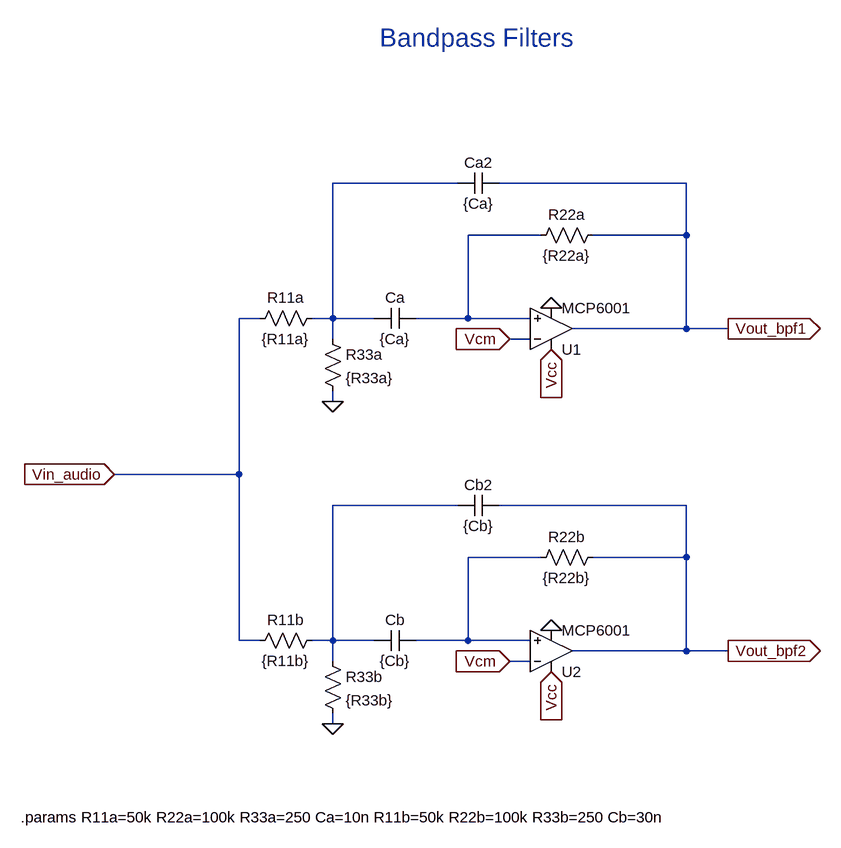
[diagram p0: schematic p6_instance.asc]
p6_instance.asc, the LTspice schematic file:
Version 4.1
SHEET 1 1460 960
WIRE 80 -96 -112 -96
WIRE 432 -96 144 -96
WIRE 208 -16 96 -16
WIRE 432 -16 432 -96
WIRE 432 -16 288 -16
WIRE -224 112 -256 112
WIRE -112 112 -112 -96
WIRE -112 112 -144 112
WIRE -48 112 -112 112
WIRE 96 112 96 -16
WIRE 96 112 16 112
WIRE 192 112 96 112
WIRE 432 128 432 -16
WIRE 432 128 256 128
WIRE 496 128 432 128
WIRE -112 144 -112 112
WIRE 192 144 160 144
WIRE -112 240 -112 224
WIRE -256 352 -256 112
WIRE -256 352 -448 352
WIRE 80 400 -112 400
WIRE 432 400 144 400
WIRE 208 480 96 480
WIRE 432 480 432 400
WIRE 432 480 288 480
WIRE -256 608 -256 352
WIRE -224 608 -256 608
WIRE -112 608 -112 400
WIRE -112 608 -144 608
WIRE -48 608 -112 608
WIRE 96 608 96 480
WIRE 96 608 16 608
WIRE 192 608 96 608
WIRE 432 624 432 480
WIRE 432 624 256 624
WIRE 496 624 432 624
WIRE -112 640 -112 608
WIRE 192 640 160 640
WIRE -112 736 -112 720
FLAG 496 128 Vout_bpf1
IOPIN 496 128 Out
FLAG 160 144 Vcm
IOPIN 160 144 In
FLAG -112 240 0
FLAG 224 160 Vcc
IOPIN 224 160 In
FLAG 224 96 0
FLAG 496 624 Vout_bpf2
IOPIN 496 624 Out
FLAG 160 640 Vcm
IOPIN 160 640 In
FLAG -112 736 0
FLAG 224 656 Vcc
IOPIN 224 656 In
FLAG 224 592 0
FLAG -448 352 Vin_audio
IOPIN -448 352 In
SYMBOL Ext_models\\MCP6001 224 128 M180
SYMATTR InstName U1
SYMBOL cap 16 96 R90
WINDOW 0 0 32 VBottom 2
WINDOW 3 32 32 VTop 2
SYMATTR InstName Ca
SYMATTR Value {Ca}
SYMBOL cap 144 -112 R90
WINDOW 0 0 32 VBottom 2
WINDOW 3 32 32 VTop 2
SYMATTR InstName Ca2
SYMATTR Value {Ca}
SYMBOL res -128 96 R90
WINDOW 0 0 56 VBottom 2
WINDOW 3 32 56 VTop 2
SYMATTR InstName R11a
SYMATTR Value {R11a}
SYMBOL res 304 -32 R90
WINDOW 0 0 56 VBottom 2
WINDOW 3 32 56 VTop 2
SYMATTR InstName R22a
SYMATTR Value {R22a}
SYMBOL res -128 128 R0
SYMATTR InstName R33a
SYMATTR Value {R33a}
SYMBOL Ext_models\\MCP6001 224 624 M180
SYMATTR InstName U2
SYMBOL cap 16 592 R90
WINDOW 0 0 32 VBottom 2
WINDOW 3 32 32 VTop 2
SYMATTR InstName Cb
SYMATTR Value {Cb}
SYMBOL cap 144 384 R90
WINDOW 0 0 32 VBottom 2
WINDOW 3 32 32 VTop 2
SYMATTR InstName Cb2
SYMATTR Value {Cb}
SYMBOL res -128 592 R90
WINDOW 0 0 56 VBottom 2
WINDOW 3 32 56 VTop 2
SYMATTR InstName R11b
SYMATTR Value {R11b}
SYMBOL res 304 464 R90
WINDOW 0 0 56 VBottom 2
WINDOW 3 32 56 VTop 2
SYMATTR InstName R22b
SYMATTR Value {R22b}
SYMBOL res -128 624 R0
SYMATTR InstName R33b
SYMATTR Value {R33b}
TEXT -592 880 Left 2 !.params R11a=50k R22a=100k R33a=250 Ca=10n R11b=50k R22b=100k R33b=250 Cb=30n
TEXT -40 -320 Left 4 ;Bandpass Filters

The netlist it stands for:
* p6_instance.asc
* U1: MCP6001 (symbol Ext_models\MCP6001 not available, pins judged from their places): In+=N002 In-=Vcm V+=Vcc V-=0 OUT=Vout_bpf1
Ca N002 N001 {Ca}
Ca2 Vout_bpf1 N001 {Ca}
R11a N001 Vin_audio {R11a}
R22a Vout_bpf1 N002 {R22a}
R33a N001 0 {R33a}
* U2: MCP6001 (symbol Ext_models\MCP6001 not available, pins judged from their places): In+=N004 In-=Vcm V+=Vcc V-=0 OUT=Vout_bpf2
Cb N004 N003 {Cb}
Cb2 Vout_bpf2 N003 {Cb}
R11b N003 Vin_audio {R11b}
R22b Vout_bpf2 N004 {R22b}
R33b N003 0 {R33b}
.params R11a=50k R22a=100k R33a=250 Ca=10n R11b=50k R22b=100k R33b=250 Cb=30n
* Bandpass Filters
.backanno
.end